# Altium schematic sheet 12_TempSensors.SchDoc
size A4; Organization: OLTEST; Revision: 01; SheetNumber: 12; SheetTotal: 13; Название листа: Название листа; Разработчик: Бондарчук С.; Прибор: R100; АМАК.000000.000 Э3: R100.230.030.000-00; Дата: 16.04.2013; Формат: A4; Workspacename: R100_Boards_v1
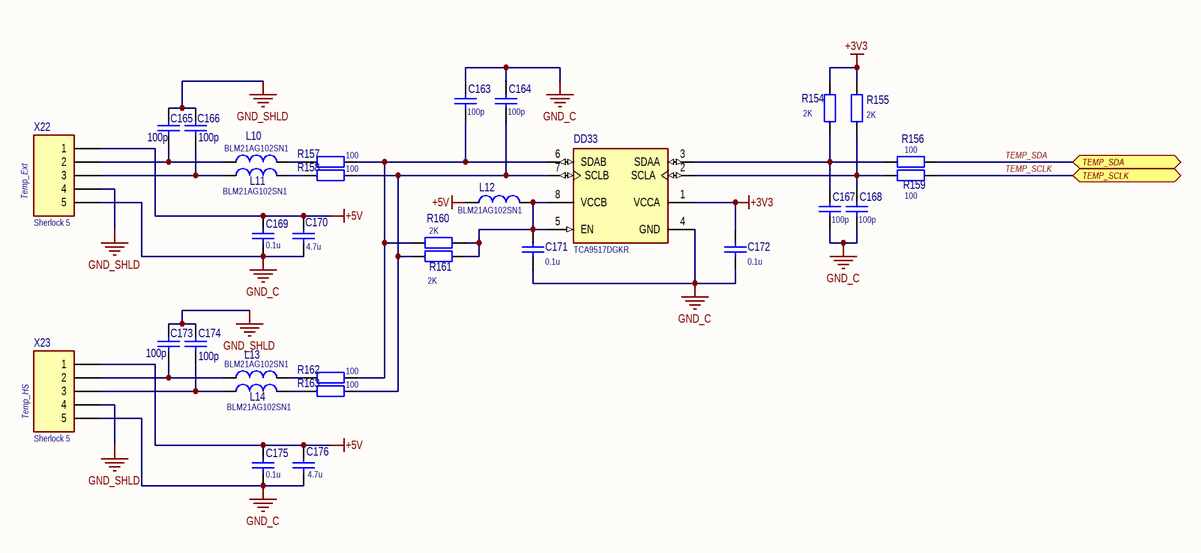
[diagram p0: 12_TempSensors.SchDoc]

## Parts
C163  100p  [SMD_C_0603]
C164  100p  [SMD_C_0603]
C165  100p  [SMD_C_0603]
C166  100p  [SMD_C_0603]
C167  100p  [SMD_C_0603]
C168  100p  [SMD_C_0603]
C169  0.1u  [SMD_C_0603]
C170  4.7u  [SMD_C_0805]
C171  0.1u  [SMD_C_0603]
C172  0.1u  [SMD_C_0603]
C173  100p  [SMD_C_0603]
C174  100p  [SMD_C_0603]
C175  0.1u  [SMD_C_0603]
C176  4.7u  [SMD_C_0805]
DD33  TCA9517DGKR  [DGK8_M]
L10  BLM21AG102SN1  [SMD_L_L2_W1.25]
L11  BLM21AG102SN1  [SMD_L_L2_W1.25]
L12  BLM21AG102SN1  [SMD_L_L2_W1.25]
L13  BLM21AG102SN1  [SMD_L_L2_W1.25]
L14  BLM21AG102SN1  [SMD_L_L2_W1.25]
R154  2K  [SMD_R_0603]
R155  2K  [SMD_R_0603]
R156  100  [SMD_R_0603]
R157  100  [SMD_R_0603]
R158  100  [SMD_R_0603]
R159  100  [SMD_R_0603]
R160  2K  [SMD_R_0603]
R161  2K  [SMD_R_0603]
R162  100  [SMD_R_0603]
R163  100  [SMD_R_0603]
X22  Sherlock 5  [35362-0550]
X23  Sherlock 5  [35362-0550]

## Ports
TEMP_SCLK, TEMP_SDA

## Nets
+3V3: C172.2 DD33.1(VCCA) R154.2 R155.2
+5V: C169.2 C170.2 C175.2 C176.2 L12.1 X22.1 X23.1
GND_C: C163.2 C164.2 C167.1 C168.1 C169.1 C170.1 C171.1 C172.1 C175.1 C176.1 DD33.4(GND) X22.5 X23.5
GND_SHLD: C165.2 C166.2 C173.2 C174.2 X22.4 X23.4
TEMP_SCLK: R159.2 ; port TEMP_SCLK
TEMP_SDA: R156.2 ; port TEMP_SDA
NetC163_1: C163.1 DD33.6(SDAB) R157.2 R160.1 R162.2
NetC164_1: C164.1 DD33.7(SCLB) R158.2 R161.1 R163.2
NetC165_1: C165.1 L10.1 X22.2
NetC166_1: C166.1 L11.1 X22.3
NetC167_2: C167.2 DD33.3(SDAA) R154.1 R156.1
NetC168_2: C168.2 DD33.2(SCLA) R155.1 R159.1
NetC171_2: C171.2 DD33.5(EN) DD33.8(VCCB) L12.2 R160.2 R161.2
NetC173_1: C173.1 L13.1 X23.2
NetC174_1: C174.1 L14.1 X23.3
NetL10_2: L10.2 R157.1
NetL11_2: L11.2 R158.1
NetL13_2: L13.2 R162.1
NetL14_2: L14.2 R163.1

## Notes on the sheet
- (near X22) Temp_Ext
- (near X23) Temp_HS
- Разработчик:
- Формат:
- Rev.:
- Лист
- Дата:
- Листов
- WorkSpace:
- Дата изм.:

## Library data of the parts
C163-C168 C173 C174 = C0603 100p 100V 5%: SMD C 0603 MURATA 100V 5% NP0; PartNumber: GRM1885C2A101JA01; Manufacturer: MURATA; Value: 100p
C169 C171 C172 C175 = C0603 0.1u 50V 10%: SMD C 0603 MURATA 50V 10% X7R; PartNumber: GRM188R71H104K; Manufacturer: MURATA; Value: 0.1u
C170 C176 = C0805 4.7u 25V 20%  X5R: SMD C 0805 MURATA 50V 5% NP0; PartNumber: GRM21BR61E475M; Manufacturer: MURATA; Value: 4.7u
DD33 = TCA9517DGKR: Level-Shifting I 2C Bus Repeater; Manufacturer: Texas Instruments; PartNumber: TCA9517DGKR
L10-L14 = BLM21AG102SN1: 1000R 0.6A (100MHz); Manufacturer: TDK; Value: 1000R 0.6A (100MHz); PartNumber: BLM21AG102SN1
R154 R155 R160 R161 = R0603 2K 1%: SMD R 0603 VISHAY 0.1W 75V 1% 100ppm; PartNumber: CRCW06032K00FK; Manufacturer: VISHAY; Value: 2K
R156-R159 R162 R163 = R0603 100 1%: SMD R 0603 VISHAY 0.1W 75V 1% 100ppm; PartNumber: CRCW0603100RFK; Manufacturer: VISHAY; Value: 100
X22 X23 = 35362-0550: Sherlock 5 Top, 2A 125V 2mm; Manufacturer: MOLEX; PartNumber: 35362-0550